# Altium schematic sheet Serial Header.SchDoc
size A4; SheetNumber: 3; SheetTotal: 6
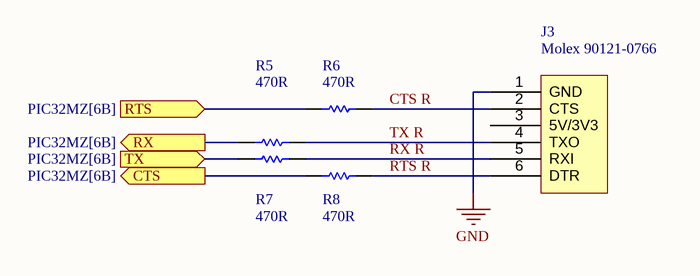
[diagram p0: Serial Header.SchDoc]

## Parts
J3  Molex 90121-0766  [Molex 90120-0926]
R5  470R  [Resistor 0402]
R6  470R  [Resistor 0402]
R7  470R  [Resistor 0402]
R8  470R  [Resistor 0402]

## Ports
CTS (out, see PIC32MZ[6B]), RTS (in, see PIC32MZ[6B]), RX (out, see PIC32MZ[6B]), TX (in, see PIC32MZ[6B])

## Nets
GND: J3.1(GND)
CTS: R8.2 ; port CTS
CTS R: J3.2(CTS) R6.1
RTS: R6.2 ; port RTS
RTS R: J3.6(DTR) R8.1
RX: R5.2 ; port RX
RX R: J3.5(RXI) R7.1
TX: R7.2 ; port TX
TX R: J3.4(TXO) R5.1

Not connected (* = marked no-connect by the designer): J3 3(5V/3V3)

## Notes on the sheet
- TITLE
- SIZE
- A4
- VARIANT
- PROJECT
- SHEET
- VERSION
- OF
- AUTHOR
- DATE

## Library data of the parts
J3 = FTDI Breakout
R5-R8 = Resistor